# Altium schematic sheet sensor-6.SchDoc
size Letter
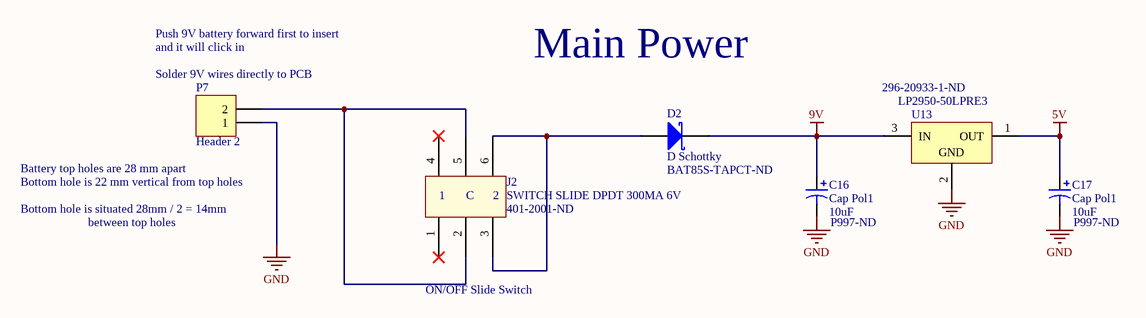
[diagram p0: sensor-6.SchDoc]

## Parts
C16  Cap Pol1  value 10uF  Supplier Part Number 1: P997-ND  [ECE-A1HKS100]
C17  Cap Pol1  value 10uF  Supplier Part Number 1: P997-ND  [ECE-A1HKS100]
D2  D Schottky  Supplier Part Number 1: BAT85S-TAPCT-ND  [BAT85S-TAP]
J2  SWITCH SLIDE DPDT 300MA 6V  Supplier Part Number 1: 401-2001-ND  [JS202011CQN]
P7  Header 2  [HDR1X2]
U13  LP2950-50LPRE3  Supplier Part Number 1: 296-20933-1-ND  [LP0003A]

## Nets
5V: C17.1 U13.1(OUT)
9V: C16.1 D2.2(K) U13.3(IN)
GND: C16.2 C17.2 P7.1 U13.2(GND)
NetD2_1: D2.1(A) J2.3 J2.6
NetJ2_2: J2.2 J2.5 P7.2

Not connected (* = marked no-connect by the designer): J2 1* 4*

## Notes on the sheet
- (near P7) Solder 9V wires directly to PCB
- Push 9V battery forward first to insert
- and it will click in
- Main Power
- (near P7) Battery top holes are 28 mm apart
- Bottom hole is 22 mm vertical from top holes
- Bottom hole is situated 28mm / 2 = 14mm
- between top holes
- ON/OFF Slide Switch
- (in symbol JS202011CQN) C

## Library data of the parts
C16 C17 = Cap Pol1: Polarized Capacitor (Radial); Manufacturer: Panasonic; Ripple Current: 35mA; Tolerance: 20%; Voltage Rating: 50V; Polarity: Polar; Life (Hours): 1000Hour; Leakage Current: 3A; Lead Diameter: 0.45mm; Published: 8-Jun-2000; LatestRevisionDate: 17-Jul-2002; LatestRevisionNote: Re-released for DXP Platform.; PackageReference: RB7.6-15; Publisher: Altium Limited; PackageDescription: Polarized Capacitor (Radial); 2 Leads; Supplier 1: Digi-Key; Manufacturer Part Number: ECE-A1HKS100; Stock 1: 132836; Pricing 1: 1=0.10000, 10=0.03000 (USD); RoHS: Yes; Mount: Through Hole,PCB; Case/Package: Radial; Number of Pins: 2; Weight: 0.01lb; Min Operating Temperature: -40°C; Max Operating Temperature: 85°C; Package Quantity: 200; Capacitance: 10uF; Packaging: Bulk; Voltage Rating (DC): 50V; Ripple Current (AC): 35mA; Termination: Radial; Voltage: 50V; Diameter: 6.3mm; Length: 5mm; Height: 5mm; Lead Pitch: 2.5mm; Width: 0.5inch; Height - Seated (Max): 0.197inch; Radiation Hardening: No; Lead Free: Lead Free; REACH SVHC: No SVHC; ComponentLink1URL: https://datasheet.ciiva.com/11778/0900766b800274c4-11778985.pdf?src-supplier=RSComponents; ComponentLink1Description: https://datasheet.ciiva.com/11778/0900766b800274c4-11778985.pdf?src-supplier=RSComponents; ComponentLink2URL: https://datasheet.ciiva.com/17536/aba0000ce15-17536597.pdf?src-supplier=Avnet+Europe; ComponentLink2Description: https://datasheet.ciiva.com/17536/aba0000ce15-17536597.pdf?src-supplier=Avnet+Europe; ComponentLink3URL: https://datasheet.ciiva.com/14594/70067878-14594328.pdf?src-supplier=Allied+Electronics; ComponentLink3Description: https://datasheet.ciiva.com/14594/70067878-14594328.pdf?src-supplier=Allied+Electronics; ComponentLink4URL: https://datasheet.ciiva.com/16205/aba0000ce15-16205737.pdf?src-supplier=Future+Electronics; ComponentLink4Description: https://datasheet.ciiva.com/16205/aba0000ce15-16205737.pdf?src-supplier=Future+Electronics; ComponentLink5URL: https://datasheet.ciiva.com/24025/a-e-461514-24025641.pdf?src-supplier=Mouser; ComponentLink5Description: https://datasheet.ciiva.com/24025/a-e-461514-24025641.pdf?src-supplier=Mouser; ComponentLink6URL: https://datasheet.ciiva.com/43459/1339471-43459545.pdf?src-supplier=Farnell; ComponentLink6Description: https://datasheet.ciiva.com/43459/1339471-43459545.pdf?src-supplier=Farnell; ComponentLink7URL: https://datasheet.ciiva.com/15166/getdatasheetpartid-169217-15166123.pdf?src-supplier=Verical; ComponentLink7Description: https://datasheet.ciiva.com/15166/getdatasheetpartid-169217-15166123.pdf?src-supplier=Verical; ComponentLink8URL: https://datasheet.ciiva.com/46397/1339471-46397117.pdf?src-supplier=Element14; ComponentLink8Description: https://datasheet.ciiva.com/46397/1339471-46397117.pdf?src-supplier=Element14; ComponentLink9URL: https://datasheet.ciiva.com/2983/aba0000ce15-2983886.pdf?src-supplier=Avnet; ComponentLink9Description: https://datasheet.ciiva.com/2983/aba0000ce15-2983886.pdf?src-supplier=Avnet
D2 = D Schottky: Schottky Diode; Manufacturer: Vishay; Forward Current: 200mA; Peak Reverse Current: 2uA; Reverse Recovery Time: 5ns; Peak Non-Repetitive Surge Current: 5A; Max Repetitive Reverse Voltage (Vrrm): 30V; Element Configuration: Single; Forward Voltage: 800mV; Published: 8-Jun-2000; LatestRevisionDate: 17-Jul-2002; LatestRevisionNote: Re-released for DXP Platform.; PackageReference: SMB; Publisher: Altium Limited; PackageDescription: DO-214-AA/SMB; 2 C-Bend Leads; Body 5.3 x 3.6 mm, inc. leads (LxW); Code_JEDEC: DO-214-AA; Supplier 1: Digi-Key; Manufacturer Part Number: BAT85S-TAP; Stock 1: 54447; Pricing 1: 1=0.38000, 10=0.31000, 100=0.16440, 500=0.10816, 1000=0.07354, 2500=0.06633, 5000=0.05768 (USD); RoHS: Yes; Mount: Through Hole; Number of Pins: 2; Contact Plating: Tin,Silver; Min Operating Temperature: -65°C; Max Operating Temperature: 125°C; Package Quantity: 10000; Packaging: Ammo Pack; Average Rectified Current: 200mA; Max Reverse Voltage (DC): 30V; Max Surge Current: 5A; Recovery Time: 5ns; Max Reverse Leakage Current: 2uA; Max Forward Surge Current (Ifsm): 5A; Length: 3.9mm; Height: 1.7mm; Width: 1.7mm; Radiation Hardening: No; Lead Free: Lead Free; ComponentLink1URL: https://datasheet.ciiva.com/23785/1749004-23785297.pdf?src-supplier=Newark; ComponentLink1Description: https://datasheet.ciiva.com/23785/1749004-23785297.pdf?src-supplier=Newark; ComponentLink2URL: https://datasheet.ciiva.com/17078/bat85s-tap-17078427.pdf?src-supplier=Allied+Electronics; ComponentLink2Description: https://datasheet.ciiva.com/17078/bat85s-tap-17078427.pdf?src-supplier=Allied+Electronics; ComponentLink3URL: https://datasheet.ciiva.com/15144/getdatasheetpartid-50689-15144221.pdf?src-supplier=Verical; ComponentLink3Description: https://datasheet.ciiva.com/15144/getdatasheetpartid-50689-15144221.pdf?src-supplier=Verical; ComponentLink4URL: https://datasheet.ciiva.com/16418/bat85s-16418454.pdf?src-supplier=Future+Electronics; ComponentLink4Description: https://datasheet.ciiva.com/16418/bat85s-16418454.pdf?src-supplier=Future+Electronics; ComponentLink5URL: https://datasheet.ciiva.com/25931/bat85s-25931304.pdf?src-supplier=Avnet+Europe; ComponentLink5Description: https://datasheet.ciiva.com/25931/bat85s-25931304.pdf?src-supplier=Avnet+Europe; ComponentLink6URL: https://datasheet.ciiva.com/13950/bat85s-13950093.pdf?src-supplier=Digi-Key; ComponentLink6Description: https://datasheet.ciiva.com/13950/bat85s-13950093.pdf?src-supplier=Digi-Key; ComponentLink7URL: https://datasheet.ciiva.com/13950/bat85s-13950090.pdf?src-supplier=Digi-Key; ComponentLink7Description: https://datasheet.ciiva.com/13950/bat85s-13950090.pdf?src-supplier=Digi-Key; ComponentLink8URL: https://datasheet.ciiva.com/8283/bat85s-8283915.pdf?src-supplier=Avnet; ComponentLink8Description: https://datasheet.ciiva.com/8283/bat85s-8283915.pdf?src-supplier=Avnet
J2 = JS202011CQN: Manufacturer: ITT C&K; Actuator Material: Nylon,Polyamide; Electrical Life: 5000Cycles; Switch Function: On-On; Illumination Type: Non-Illuminated; Contact Current Rating: 100mA; Contact Resistance: 70mR; Switch Travel: 2mm; Actuator Type: Standard; Supplier 1: Digi-Key; Manufacturer Part Number: JS202011CQN; Stock 1: 30365; Pricing 1: 1=0.43000, 10=0.41600, 25=0.40720, 50=0.36380, 100=0.34650, 250=0.33784, 500=0.28586, 1000=0.27720, 5000=0.24255 (USD); RoHS: Yes; Mount: Through Hole; Contact Plating: Silver; Contact Material: Copper Alloy; Housing Material: Nylon; Min Operating Temperature: -40°C; Max Operating Temperature: 85°C; Package Quantity: 1; Packaging: Bulk; Termination: PC Pins; Voltage Rating (DC): 6V; Throw Configuration: DPDT; Current Rating: 300mA; Max Voltage Rating (DC): 6V; Max Current Rating: 300mA; Orientation: Vertical; Length: 9mm; Actuator Length: 2mm; Depth: 3.6mm; Radiation Hardening: No; Lead Free: Lead Free; REACH SVHC: No SVHC; Flammability Rating: UL94 V-0; ComponentLink1URL: https://datasheet.ciiva.com/5280/js-15sept15-5280375.pdf?src-supplier=Mouser; ComponentLink1Description: https://datasheet.ciiva.com/5280/js-15sept15-5280375.pdf?src-supplier=Mouser; ComponentLink2URL: https://datasheet.ciiva.com/22630/1707718-22630695.pdf?src-supplier=Element14; ComponentLink2Description: https://datasheet.ciiva.com/22630/1707718-22630695.pdf?src-supplier=Element14; ComponentLink3URL: https://datasheet.ciiva.com/8082/js-9dec14-8082522.pdf?src-supplier=Avnet; ComponentLink3Description: https://datasheet.ciiva.com/8082/js-9dec14-8082522.pdf?src-supplier=Avnet; ComponentLink4URL: https://datasheet.ciiva.com/2889/js-9dec14-2889166.pdf?src-supplier=Digi-Key; ComponentLink4Description: https://datasheet.ciiva.com/2889/js-9dec14-2889166.pdf?src-supplier=Digi-Key
P7 = Header 2: Header, 2-Pin; LatestRevisionDate: 17-Jul-2002; LatestRevisionNote: Re-released for DXP Platform.; Publisher: Altium Limited
U13 = CMP-0758-00015-2: Single Output LDO, 100 mA, Fixed 5 V Output, 5.4 to 30 V Input, 3-Pin TO-92 (LP), RoHS, Tape and Reel; Manufacturer: Texas Instruments; Output Capacitor Type: Non-Ceramic; Rating: Catalog; Vout (Min) (V): 4.95; Fixed Output Options (V): 5; Output Options: Fixed Output; Accuracy (%): 1.4; Vin (Max) (V): 30; Vin (Min) (V): 5.4; Vdo (Typ) (mV): 380; Vout (Max) (V): 5.05; Iq (Typ) (mA): 0.075; Iout (Max) (A): 0.1; Dropout Voltage: 380mV; Output Current: 100mA; Number of Outputs: 1; Output Voltage: 5V; Min Supply Voltage: 2V; Max Input Voltage: 30V; Min Input Voltage: 5.4V; Input Bias Current: 75uA; Polarity: Positive; Min Output Voltage: 4.95V; Accuracy: 1.4%; Max Output Voltage: 5.05V; PackageDescription: 3-Pin Plastic Cylindrical Package, Body Dia 4.825 mm, Pitch 2.65 mm; PartNumber: LP2950-50LPRE3; RoHS: TRUE; ComponentLink3Description: Package Specification; DatasheetVersion: SLVS582H; ComponentLink2Description: Datasheet; ComponentLink3URL: http://www.ti.com/lit/ml/msot002c/msot002c.pdf; ComponentLink1Description: Manufacturer URL; ComponentLink1URL: http://www.ti.com/; ComponentLink2URL: http://www.ti.com/lit/ds/symlink/lp2950-30.pdf; Packing: Tape and Reel; PackageVersion: 4040001-2/E; Mounting Technology: Through Hole; PackageReference: LP0003A; Supplier 1: Digi-Key; Manufacturer Part Number: LP2950-50LPRE3; Stock 1: 99647; Pricing 1: 1=0.47000, 10=0.40200, 100=0.29990, 500=0.23566, 1000=0.18210 (USD); Case/Package: TO-92; Number of Pins: 3; Contact Plating: Tin,Matte; Min Operating Temperature: -40°C; Max Operating Temperature: 125°C; Package Quantity: 1; Nominal Output Voltage: 5V; Max Output Current: 100mA; Packaging: Tape and Reel; Number of Regulators: 1; Quiescent Current: 75uA; Termination: Through Hole; Output Voltage Accuracy: 1.4%; Output Type: Fixed; Length: 4.83mm; Height: 3.68mm; Width: 3.43mm; Radiation Hardening: No; REACH SVHC: No SVHC; Lead Free: Lead Free; ComponentLink4URL: https://datasheet.ciiva.com/2041/lp2951-2041968.pdf?src-supplier=Digi-Key; ComponentLink4Description: https://datasheet.ciiva.com/2041/lp2951-2041968.pdf?src-supplier=Digi-Key; ComponentLink5URL: https://datasheet.ciiva.com/3223/lp2951-33-3223814.pdf?src-supplier=Avnet; ComponentLink5Description: https://datasheet.ciiva.com/3223/lp2951-33-3223814.pdf?src-supplier=Avnet; ComponentLink6URL: https://datasheet.ciiva.com/1511/1864445-1511850.pdf?src-supplier=Element14; ComponentLink6Description: https://datasheet.ciiva.com/1511/1864445-1511850.pdf?src-supplier=Element14; ComponentLink7URL: https://datasheet.ciiva.com/46448/1445037-46448763.pdf?src-supplier=Element14; ComponentLink7Description: https://datasheet.ciiva.com/46448/1445037-46448763.pdf?src-supplier=Element14; ComponentLink8URL: https://datasheet.ciiva.com/2041/lp2951-2041966.pdf?src-supplier=Digi-Key; ComponentLink8Description: https://datasheet.ciiva.com/2041/lp2951-2041966.pdf?src-supplier=Digi-Key; ComponentLink9URL: https://datasheet.ciiva.com/2041/lp2951-2041967.pdf?src-supplier=Digi-Key; ComponentLink9Description: https://datasheet.ciiva.com/2041/lp2951-2041967.pdf?src-supplier=Digi-Key